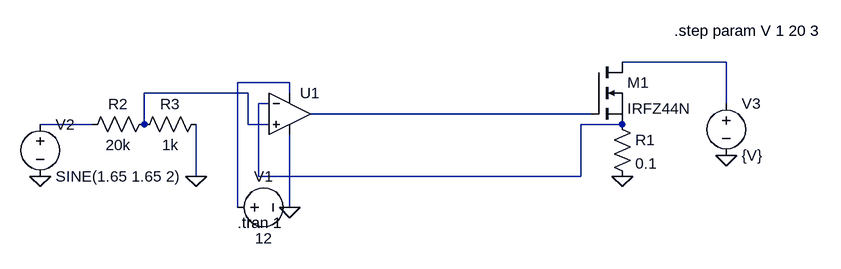
[diagram p0: schematic Mosfet_Constant_Current_Load.asc]
Mosfet_Constant_Current_Load.asc, the LTspice schematic file:
Version 4.1
SHEET 1 916 680
WIRE 752 80 592 80
WIRE 80 112 0 112
WIRE 16 128 -144 128
WIRE 80 128 80 112
WIRE 48 144 32 144
WIRE 752 144 752 80
WIRE 544 160 112 160
WIRE -224 176 -304 176
WIRE -144 176 -144 128
WIRE 16 176 16 128
WIRE 48 176 16 176
WIRE 592 176 528 176
WIRE -64 256 -64 176
WIRE 32 256 32 144
WIRE 528 256 528 176
WIRE 528 256 32 256
WIRE 0 304 0 112
WIRE 80 304 80 192
FLAG 80 304 0
FLAG 592 256 0
FLAG -304 256 0
FLAG 752 224 0
FLAG -64 256 0
SYMBOL OpAmps\\UniversalOpAmp2 80 160 R0
SYMATTR InstName U1
SYMBOL voltage -16 304 R270
WINDOW 0 32 56 VTop 2
WINDOW 3 -32 56 VBottom 2
WINDOW 123 0 0 Left 0
WINDOW 39 0 0 Left 0
SYMATTR InstName V1
SYMATTR Value 12
SYMBOL res 576 160 R0
SYMATTR InstName R1
SYMATTR Value 0.1
SYMBOL voltage -304 160 R0
WINDOW 123 0 0 Left 0
WINDOW 39 0 0 Left 0
SYMATTR InstName V2
SYMATTR Value SINE(1.65 1.65 2)
SYMBOL voltage 752 128 R0
WINDOW 123 0 0 Left 0
WINDOW 39 0 0 Left 0
SYMATTR InstName V3
SYMATTR Value {V}
SYMBOL res -128 160 R90
WINDOW 0 0 56 VBottom 2
WINDOW 3 32 56 VTop 2
SYMATTR InstName R2
SYMATTR Value 20k
SYMBOL res -48 160 R90
WINDOW 0 0 56 VBottom 2
WINDOW 3 32 56 VTop 2
SYMATTR InstName R3
SYMATTR Value 1k
SYMBOL nmos 544 80 R0
SYMATTR InstName M1
SYMATTR Value IRFZ44N
TEXT 0 328 Left 2 !.tran 1
TEXT 672 32 Left 2 !.step param V 1 20 3

The netlist it stands for:
* Mosfet_Constant_Current_Load.asc
X§U1 N003 N004 N002 0 N005 level2 Avol=1Meg GBW=10Meg Slew=10Meg Ilimit=25m Rail=0 Vos=0 En=0 Enk=0 In=0 Ink=0 Rin=500Meg  ; pins In+ In- V+ V- OUT
V1 N002 0 12
R1 N004 0 0.1
V2 N006 0 SINE(1.65 1.65 2)
V3 N001 0 {V}
R2 N003 N006 20k
R3 0 N003 1k
M1 N001 N005 N004 N004 IRFZ44N
.model NMOS NMOS
.model PMOS PMOS
.lib standard.mos
.tran 1
.step param V 1 20 3
.lib UniversalOpAmp2.lib
.backanno
.end